# EAGLE design stirrer (EAGLE 7.2.0)
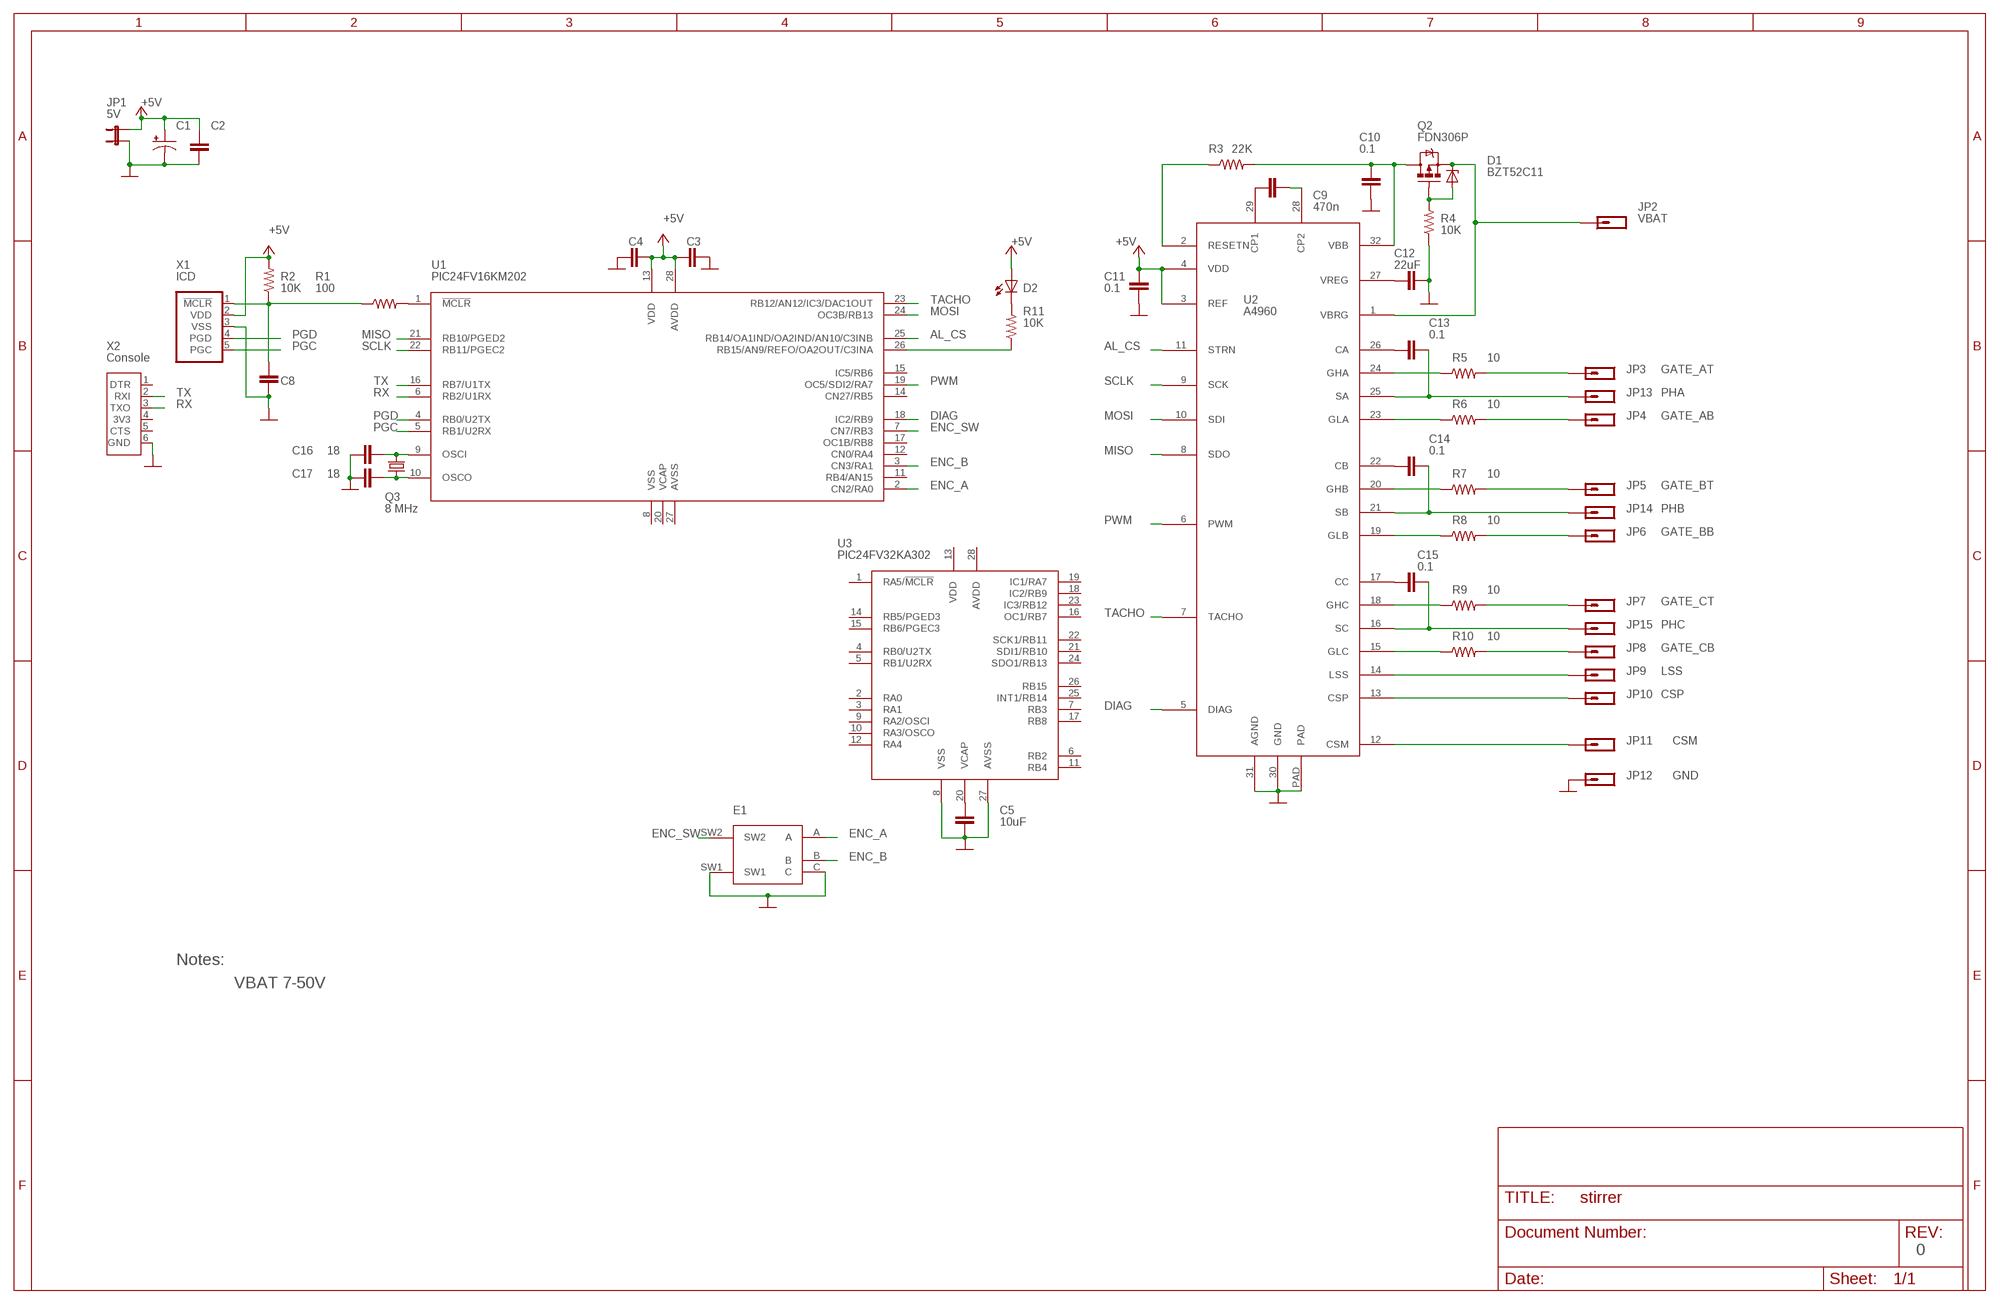
[diagram p0: schematic, sheet 1]

## Parts
C1  CAP_POL-RAD8  [CAP_RAD_8MM]
C2  CAP0603  [0603]
C3  0.1uF  C-0603  [0603]
C4  0.1uF  C-0603  [0603]
C5  10uF  C-0603  [0603]
C8  0.1uF  C-0603  [0603]
C9  470n  C-0603  [0603]
C10  0.1  C-0603  [0603]
C11  0.1  C-0603  [0603]
C12  22uF  CAP1206  [1206]
C13  0.1  C-0603  [0603]
C14  0.1  C-0603  [0603]
C15  0.1  C-0603  [0603]
C16  18  C-0603  [0603]
C17  18  C-0603  [0603]
D1  BZT52C11  ZENER-SOD-123  [SOD-123]
D2  LED5MM  [LED5MM]
E1  ROTARY_ENCODER_SWITCH-LUT  [PEC12-LUT]
JP1  5V  JP1EPTH  [1X02]
JP2  VBAT  M01-TT  [1X01_TT]
JP3  GATE_AT  M01-TT  [1X01_TT]
JP4  GATE_AB  M01-TT  [1X01_TT]
JP5  GATE_BT  M01-TT  [1X01_TT]
JP6  GATE_BB  M01-TT  [1X01_TT]
JP7  GATE_CT  M01-TT  [1X01_TT]
JP8  GATE_CB  M01-TT  [1X01_TT]
JP9  LSS  M01-TT  [1X01_TT]
JP10  CSP  M01-TT  [1X01_TT]
JP11  CSM  M01-TT  [1X01_TT]
JP12  GND  M01-TT  [1X01_TT]
JP13  PHA  M01-TT  [1X01_TT]
JP14  PHB  M01-TT  [1X01_TT]
JP15  PHC  M01-TT  [1X01_TT]
Q2  FDN306P  MOSFET-PCHANNEL-DPAK  [DPAK]
Q3  8 MHz  CRYSTAL_SFEHC49US  [HC49US]
R1  100  RESISTOR-0603  [0603]
R2  10K  RESISTOR-0603  [0603]
R3  22K  RESISTOR-0603  [0603]
R4  10K  RESISTOR-0603  [0603]
R5  10  RESISTOR-0603  [0603]
R6  10  RESISTOR-0603  [0603]
R7  10  RESISTOR-0603  [0603]
R8  10  RESISTOR-0603  [0603]
R9  10  RESISTOR-0603  [0603]
R10  10  RESISTOR-0603  [0603]
R11  10K  RESISTOR-0603  [0603]
U1  PIC24FV16KM202  PIC24FX16KM202-DIP  [DIL28-3]
U2  A4960  [LQPF-32]
U3  PIC24FV32KA302  PIC24FV32KA302_STIR-DIP  [DIL28-3]
X1  ICD  PIC_ICD-TT  [1X05-TT]
X2  Console  SERIAL-SFTT  [1X06TT]

## Nets
+5V: C1.P(+) C2.1 C3.1 C4.2 C11.2 D2.A JP1.2 R2.2 U1.13(VDD) U1.28(AVDD) U2.3(REF) U2.4(VDD) X1.2(VDD)
AL_CS: U1.25(RB14/OA1IND/OA2IND/AN10/C3INB) U2.11(STRN)
CSM: JP11.1 U2.12(CSM)
CSP: JP10.1 U2.13(CSP)
DIAG: U1.18(IC2/RB9) U2.5(DIAG)
ENC_A: E1.A U1.2(CN2/RA0)
ENC_B: E1.B U1.3(CN3/RA1)
ENC_SW: E1.SW2 U1.7(CN7/RB3)
GATE_AB: JP4.1 R6.2
GATE_AT: JP3.1 R5.2
GATE_BB: JP6.1 R8.2
GATE_BT: JP5.1 R7.2
GATE_CB: JP8.1 R10.2
GATE_CT: JP7.1 R9.2
GND: C1.N(-) C2.2 C3.2 C4.1 C5.2 C8.1 C10.1 C11.1 C12.2 C16.1 C17.1 E1.C E1.SW1 JP1.1 JP12.1 R4.1 U2.30(GND) U2.31(AGND) U2.PAD U3.8(VSS) U3.27(AVSS) X1.3(VSS) X2.6(GND)
LSS: JP9.1 U2.14(LSS)
MISO: U1.21(RB10/PGED2) U2.8(SDO)
MOSI: U1.24(OC3B/RB13) U2.10(SDI)
N$1: C5.1 U3.20(VCAP)
N$2: R1.2 U1.1(!MCLR)
N$3: R11.1 U1.26(RB15/AN9/REFO/OA2OUT/C3INA)
N$5: C9.1 U2.29(CP1)
N$9: D2.K(C) R11.2
N$11: C9.2 U2.28(CP2)
N$12: C8.2 R1.1 R2.1 X1.1(!MCLR)
N$14: R3.1 U2.2(RESETN)
N$15: C10.2 Q2.4(D) R3.2 U2.32(VBB)
N$16: C12.1 U2.27(VREG)
N$17: C13.2 U2.26(CA)
N$18: D1.A Q2.1(G) R4.2
N$19: C14.2 U2.22(CB)
N$20: C15.2 U2.17(CC)
N$21: C13.1 JP13.1 U2.25(SA)
N$22: C14.1 JP14.1 U2.21(SB)
N$23: C15.1 JP15.1 U2.16(SC)
N$24: R5.1 U2.24(GHA)
N$25: R7.1 U2.20(GHB)
N$26: R9.1 U2.18(GHC)
N$27: R6.1 U2.23(GLA)
N$28: R8.1 U2.19(GLB)
N$29: R10.1 U2.15(GLC)
N$30: C16.2 Q3.2 U1.9(OSCI)
N$31: C17.2 Q3.1 U1.10(OSCO)
PGC: U1.5(RB1/U2RX) X1.5(PGC)
PGD: U1.4(RB0/U2TX) X1.4(PGD)
PWM: U1.19(OC5/SDI2/RA7) U2.6(PWM)
RX: U1.6(RB2/U1RX) X2.3(TXO)
SCLK: U1.22(RB11/PGEC2) U2.9(SCK)
TACHO: U1.23(RB12/AN12/IC3/DAC1OUT) U2.7(TACHO)
TX: U1.16(RB7/U1TX) X2.2(RXI)
VBAT: D1.K(C) JP2.1 Q2.3(S) U2.1(VBRG)
Unconnected: U1.8(VSS) U1.11(RB4/AN15) U1.12(CN0/RA4) U1.14(CN27/RB5) U1.15(IC5/RB6) U1.17(OC1B/RB8) U1.20(VCAP) U1.27(AVSS) U3.1(RA5/!MCLR) U3.2(RA0) U3.3(RA1) U3.4(RB0/U2TX) U3.5(RB1/U2RX) U3.6(RB2) U3.7(RB3) U3.9(RA2/OSCI) U3.10(RA3/OSCO) U3.11(RB4) U3.12(RA4) U3.13(VDD) U3.14(RB5/PGED3) U3.15(RB6/PGEC3) U3.16(OC1/RB7) U3.17(RB8) U3.18(IC2/RB9) U3.19(IC1/RA7) U3.21(SDI1/RB10) U3.22(SCK1/RB11) U3.23(IC3/RB12) U3.24(SDO1/RB13) U3.25(INT1/RB14) U3.26(RB15) U3.28(AVDD) X2.1(DTR) X2.4(3V3) X2.5(CTS)

## Notes on the sheet
- Notes:
- VBAT 7-50V
- 0

## Library data of the parts
C1 = ch_passive:CAP_POL: Capacitor Polarized These are standard SMD and PTH capacitors. Normally 10uF, 47uF, and 100uF in electrolytic and tantalum varieties. Always verify the external diameter of the through hole cap, it varies with capacity, voltage, and manufacturer. The EIA devices should be standard.
C2 C12 = ch_passive:CAP: Capacitor Standard 0603 ceramic capacitor, and 0.1" leaded capacitor.
C3-C5 C8-C11 C13-C17 = ch_passive:C: CAPACITOR naming: grid - package width
D1 = ch_generic:ZENER: Zener Diode
D2 = ch_generic:LED: LEDs Standard schematic elements and footprints for 5mm, 3mm, 1206, and 0603 sized LEDs. 5mm - Spark Fun Electronics SKU : COM-00529 (and others)
E1 = ch_electromech:ROTARY_ENCODER_SWITCH: Rotary Encoder PEC12_HOR - Bourns horizontal PEC12
JP1 = ch_connectors:JP1E: Jumper Basic 0.1" spaced jumper. Use with breakaway headers.
JP2-JP15 = ch_connectors:M01: Header 1 Standard 1-pin 0.1" header. Use with straight break away headers (SKU : PRT-00116), right angle break away headers (PRT-00553), swiss pins (PRT-00743), machine pins (PRT-00117), and female headers (PRT-00115).
Q2 = ch_generic:MOSFET-PCHANNEL: MOSFET-P
Q3 = ch_passive:CRYSTAL_SFE: Crystals Various standard crystals
R1-R11 = ch_passive:RESISTOR: Resistor Basic schematic elements and footprints for 0603, 1206, and PTH 1/10th watt (small) resistors.
U1 = ch_microchip:PIC24FX16KM202
U2 = ch_allegro:A4960
U3 = ch_microchip:PIC24FV32KA302_STIR
X1 = ch_connectors:PIC_ICD
X2 = ch_connectors:SERIAL

## Board
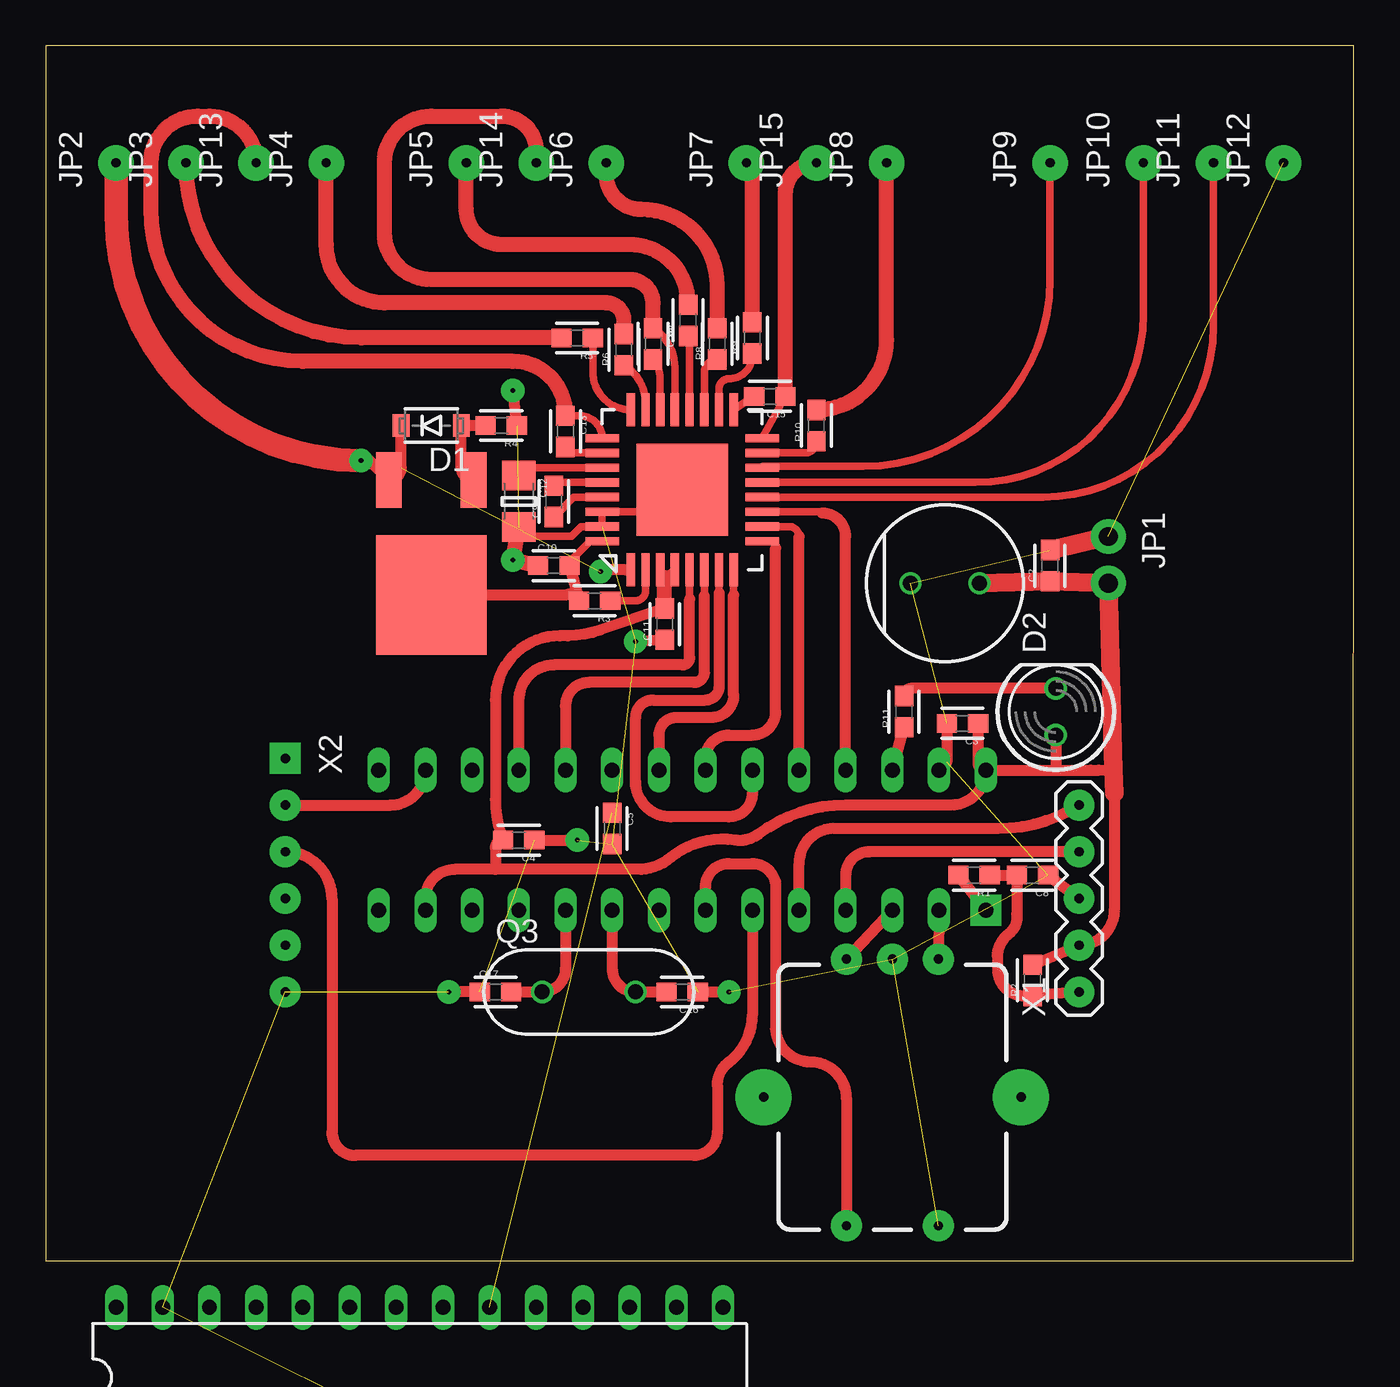
[diagram p1: board, top side]
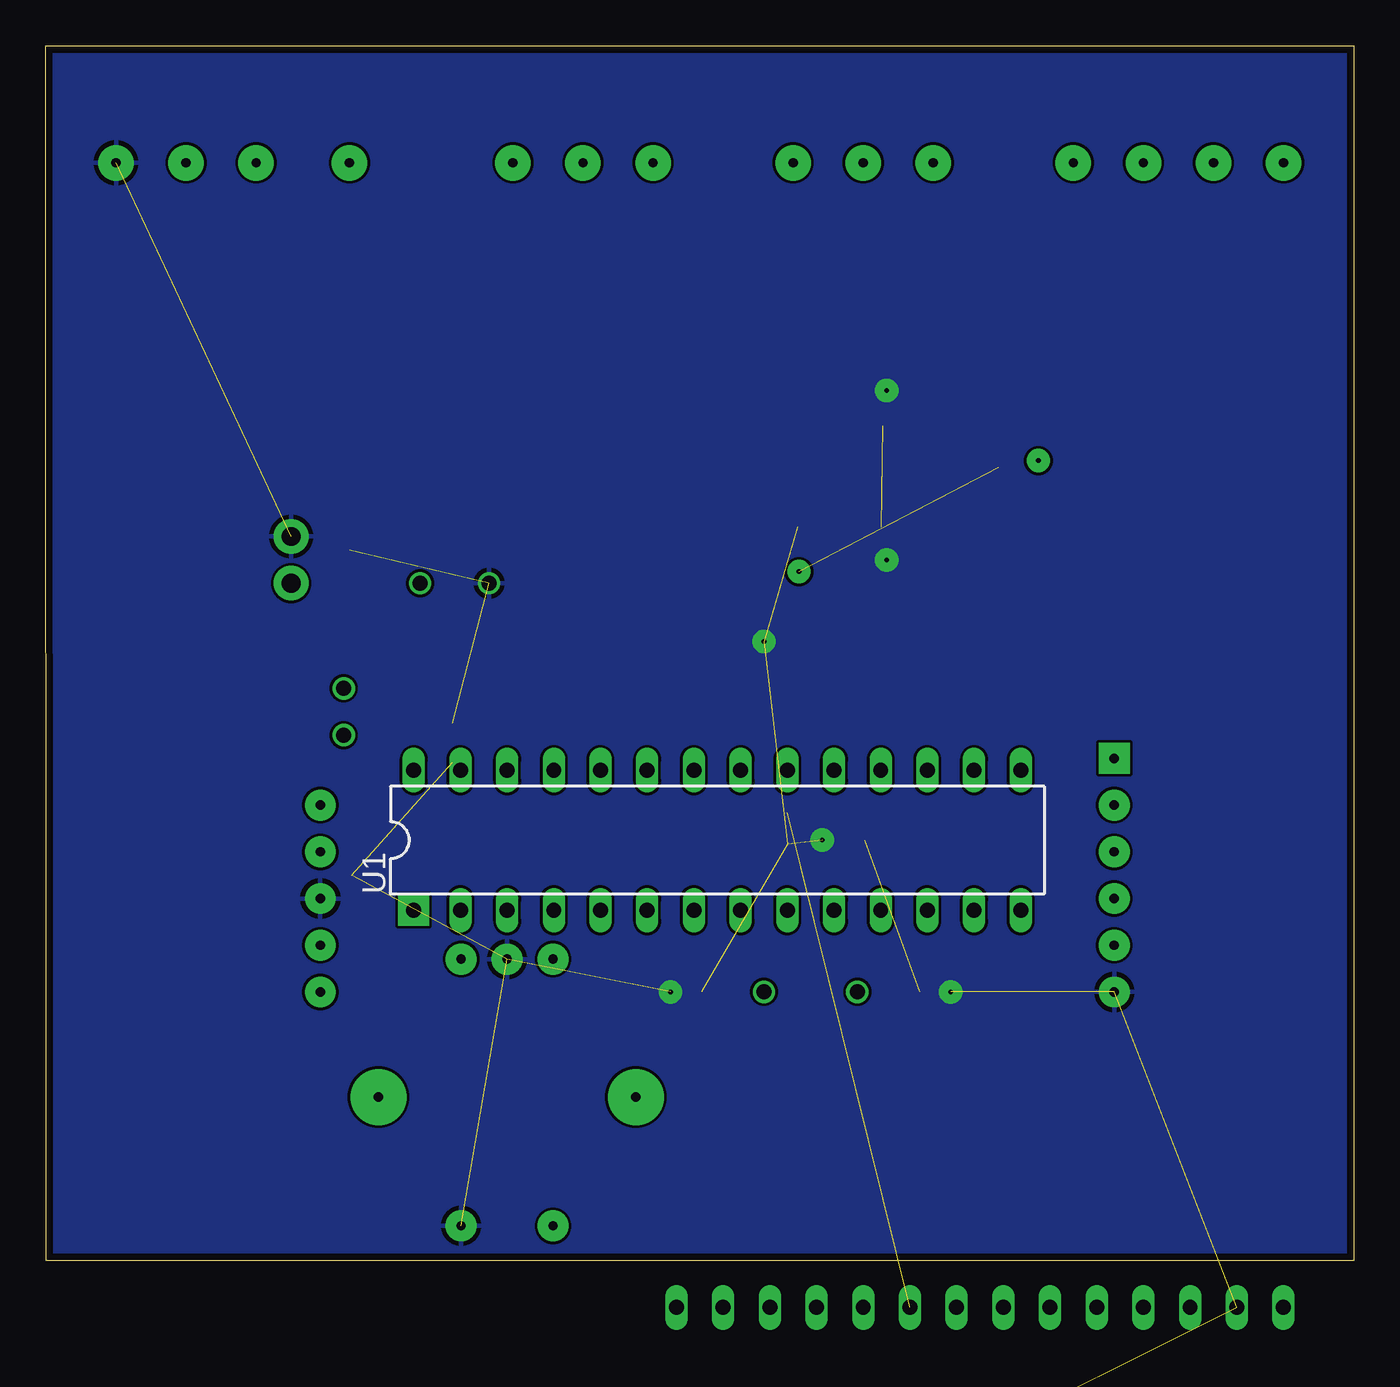
[diagram p2: board, bottom side, seen from below]

Size 71.12 x 66.04 mm. Coordinates in mm from the lower left corner, seen from the top.
Outline: 0,0 71.1,0 71.12,66.04 0,66.04 0,0
Copper layers (1*16): Top 0.0356mm / dielectric 1.5011mm / Bottom 0.0356mm
Design rules "CH_TT": minimum track width 6mil, minimum drill 1mil, track to track 6mil, track to pad 6mil, pad to pad 6mil, via to via 6mil, smd to smd 6mil, copper to edge 15mil, drill to drill 6mil, minimum pad ring 7mil, minimum via ring 7mil, stop-mask expansion 4mil, vias tented up to drill 20mil, thermal gap 10mil

### Footprints (pad centres in the part's own frame; a part is rotated, then mirrored left to right if it is on the bottom)
CAP_RAD_8MM = drill 0.8: N -1.875,0; P 1.875,0
0603 = smd 1.1 x 1: 1 -0.85,0; 2 0.85,0
1206 = smd 1.6 x 1.8: 1 -1.4,0; 2 1.4,0
SOD-123 = smd 0.91 x 1.22: A -1.635,0; K 1.635,0
LED5MM = drill 0.813: A -1.27,0; K 1.27,0
PEC12-LUT = drill 0.508 pad 1.676: A -2.5,-7.5; B 2.5,-7.5; C 0,-7.5; SW1 -2.5,7; SW2 2.5,7 | drill 0.508 pad 3.048: P$1 -7,0; P$2 7,0
1X02 = drill 1.016 pad 1.88: 1 0,0; 2 2.54,0
1X01_TT = drill 0.508 pad 1.93: 1 0,0
DPAK = smd 1.4 x 3: 1 -2.3,-6.25; 3 2.3,-6.25 | smd 6 x 6.5: 4 0,0
HC49US = drill 0.813: 1 -2.54,0; 2 2.54,0
DIL28-3 = drill 0.813 pad 1.676 square: 1 -16.51,-3.81 | drill 0.813 long: 2 -13.97,-3.81; 3 -11.43,-3.81; 4 -8.89,-3.81; 5 -6.35,-3.81; 6 -3.81,-3.81; 7 -1.27,-3.81; 8 1.27,-3.81; 9 3.81,-3.81; 10 6.35,-3.81; 11 8.89,-3.81; 12 11.43,-3.81; 13 13.97,-3.81; 14 16.51,-3.81; 15 16.51,3.81; 16 13.97,3.81; 17 11.43,3.81; 18 8.89,3.81; 19 6.35,3.81; 20 3.81,3.81; 21 1.27,3.81; 22 -1.27,3.81; 23 -3.81,3.81; 24 -6.35,3.81; 25 -8.89,3.81; 26 -11.43,3.81; 27 -13.97,3.81; 28 -16.51,3.81
LQPF-32 = smd 0.45 x 1.8: 1 -2.8,-4.35; 2 -2,-4.35; 3 -1.2,-4.35; 4 -0.4,-4.35; 5 0.4,-4.35; 6 1.2,-4.35; 7 2,-4.35; 8 2.8,-4.35; 17 2.8,4.35; 18 2,4.35; 19 1.2,4.35; 20 0.4,4.35; 21 -0.4,4.35; 22 -1.2,4.35; 23 -2,4.35; 24 -2.8,4.35 | smd 1.8 x 0.45: 9 4.35,-2.8; 10 4.35,-2; 11 4.35,-1.2; 12 4.35,-0.4; 13 4.35,0.4; 14 4.35,1.2; 15 4.35,2; 16 4.35,2.8; 25 -4.35,2.8; 26 -4.35,2; 27 -4.35,1.2; 28 -4.35,0.4; 29 -4.35,-0.4; 30 -4.35,-1.2; 31 -4.35,-2; 32 -4.35,-2.8 | smd 5 x 5: PAD 0,0
1X05-TT = drill 0.508 pad 1.676: 1 -5.08,0; 2 -2.54,0; 3 0,0; 4 2.54,0; 5 5.08,0
1X06TT = drill 0.508 pad 1.676 square: 1 -6.35,0 | drill 0.508 pad 1.676: 2 -3.81,0; 3 -1.27,0; 4 1.27,0; 5 3.81,0; 6 6.35,0

### Placement (x,y rotation side)
C1  48.9,36.83 0 top
C2  54.61,37.78 90 top
C3  49.85,29.21 180 top
C4  25.72,22.86 180 top
C5  30.8,23.5 270 top
C8  53.66,20.95 180 top
C9  27.62,41.27 90 top
C10  27.62,37.78 0 top
C11  33.66,34.61 90 top
C12  25.72,41.27 270 top
C13  28.26,45.09 270 top
C14  33.02,49.85 270 top
C15  39.37,46.99 180 top
C16  34.61,14.61 180 top
C17  24.45,14.61 0 top
D1  20.95,45.4 180 top
D2  54.93,29.84 90 top
E1  46.04,8.89 180 top
JP1  57.78,39.37 270 top
JP2  3.81,59.69 90 top
JP3  7.62,59.69 90 top
JP4  15.24,59.69 90 top
JP5  22.86,59.69 90 top
JP6  30.48,59.69 90 top
JP7  38.1,59.69 90 top
JP8  45.72,59.69 90 top
JP9  54.61,59.69 90 top
JP10  59.69,59.69 90 top
JP11  63.5,59.69 90 top
JP12  67.31,59.69 90 top
JP13  11.43,59.69 90 top
JP14  26.67,59.69 90 top
JP15  41.91,59.69 90 top
Q2  20.95,36.2 180 top
Q3  29.53,14.61 0 top
R1  50.48,20.95 180 top
R2  53.66,15.24 90 top
R3  29.84,35.88 180 top
R4  24.77,45.4 180 top
R5  28.89,50.16 180 top
R6  31.43,49.53 90 top
R7  34.92,51.12 90 top
R8  36.51,49.85 90 top
R9  38.42,50.16 90 top
R10  41.91,45.4 90 top
R11  46.67,29.84 90 top
U1  34.61,22.86 0 bottom
U2  34.61,41.91 0 top
U3  20.32,-6.35 0 top
X1  56.2,19.68 90 top
X2  13.02,20.95 270 top

### Tracks (layer width: path | path; a pad name or v marks a point on that pad's centre or on a via)
+5V
  Top 0.406: U2.4 33.66,37.15 U2.3
  Top 0.61: C3.1 50.7,27.09 arc90 U1.28 | R2.2 X1.2 arc90 58.1,19.05 58.1,25.4 | U1.13 20.64,19.68 arc-90 22.23,21.27 24.45,21.27 | U1.28 54.93,26.67 | 54.93,26.67 56.83,26.67 arc2 58.07,26.69 | D2.A 54.93,26.67 | U1.28 arc-90 49.21,24.77 43.5,24.77 arc37 38.73,23.18 arc-46 37.47,22.86 arc48 33.97,21.91 arc-35 32.38,21.27 24.45,21.27 | 24.45,21.27 24.45,22.44 arc-90 C4.2 arc-21 24.45,25.08 24.45,30.48 arc-90 27.94,33.97 arc21 30.16,34.29 C11.2
  Top 0.813: C11.2 33.66,37.15
  Top 1.016: C1.P C2.1 JP1.2 58.07,26.69 58.1,25.4
AL_CS
  Top 0.406: U2.11 42.16,40.71 arc-90 42.23,40.64
  Top 0.61: U1.25 43.5,39.37 arc90 42.23,40.64
CSM
  Top 0.406: U2.12 54.21,41.51 arc90 63.5,50.8 JP11.1
CSP
  Top 0.406: U2.13 50.56,42.31 arc90 59.69,51.44 JP10.1
DIAG
  Top 0.406: U2.5 35.01,35.96
  Top 0.61: U1.18 25.72,30.48 arc-90 27.62,32.38 34.61,32.38 arc90 35.01,32.78 35.01,35.96
ENC_A
  Top 0.61: U1.2 E1.A
ENC_B
  Top 0.61: U1.3 E1.B
ENC_SW
  Top 0.61: U1.7 35.88,20.32 arc-90 37.15,21.59 38.42,21.59 arc-90 39.69,20.32 39.69,12.7 arc90 41.59,10.79 arc-90 43.54,8.85 E1.SW2
GATE_AB
  Top 0.813: R6.2 31.43,51.12 arc90 30.48,52.07 18.41,52.07 arc-90 15.24,55.24 JP4.1
GATE_AT
  Top 0.813: R5.2 17.14,50.16 arc-90 JP3.1
GATE_BB
  Top 0.813: R8.2 36.51,53.02 arc90 32.38,57.15 arc-90 30.48,59.05 JP6.1
GATE_BT
  Top 0.813: R7.2 34.92,52.07 arc90 31.75,55.24 24.77,55.24 arc-90 22.86,57.15 JP5.1
GATE_CB
  Top 0.813: R10.2 arc90 45.72,50.06 JP8.1
GATE_CT
  Top 0.813: R9.2 38.42,59.37 arc90 JP7.1
GND  (via drill 0.25 pad 1.27)  (16 unrouted)
  Top 0.406: C12.2 26.22,39.37 28.57,39.37 29.11,39.91 U2.31 U2.30 33.41,40.71 arc90 U2.PAD
  Top 0.61: C3.2 49,27.09 | C11.1 v32.07,33.66 | C4.1 v28.89,22.86 | C17.1 v21.91,14.61 | C16.1 v37.15,14.61 | C8.1 X1.3 | R4.1 v25.4,47.31
  Top 0.813: C12.2 v25.4,38.1 C10.1
  Top 1.016: C2.2 JP1.1
  pour Bottom: 0,0 71.12,0 71.12,66.04 0,66.04
LSS
  Top 0.406: U2.14 arc-90 39.03,43.18 44.45,43.18 arc90 54.61,53.34 JP9.1
MISO
  Top 0.406: 37.41,35.82 37.41,36.2 U2.8
  Top 0.61: 37.41,36.2 37.41,30.74 arc-90 36.2,29.53 34.29,29.53 arc90 33.34,28.57 U1.21
MOSI
  Top 0.406: U2.10 40.42,39.91 arc-90 40.96,39.37
  Top 0.61: U1.24 40.96,39.37
N$1  (1 unrouted)
N$2
  Top 0.61: R1.2 U1.1
N$3
  Top 0.61: U1.26 R11.1
N$5
  Top 0.406: U2.29 28.71,41.51 C9.1
N$9
  Top 0.61: D2.K 47.09,31.11 arc90 R11.2
N$11
  Top 0.406: U2.28 27.81,42.31 arc90 C9.2
N$12
  Top 0.61: X1.1 R2.1 53.24,14.39 arc-90 51.75,15.88 51.75,16.51 arc-53 52.39,17.78 arc63 52.81,18.84 C8.2 R1.1
N$14
  Top 0.406: U2.2 32.61,36.42 arc-90 32.07,35.88 R3.1
N$15
  Top 0.406: U2.32 29.59,39.11 28.47,38 C10.2
  Top 0.61: C10.2 28.86,36.36 | 28.86,36.36 R3.2 | Q2.4 28.26,36.2 28.86,36.36
N$16
  Top 0.406: U2.27 25.52,43.11 arc90 C12.1
N$17
  Top 0.406: U2.26 28.58,43.91 arc-90 C13.2
N$18
  Top 0.61: Q2.1 arc-90 22.59,43.11 D1.A R4.2
N$19
  Top 0.406: U2.22 33.41,47.98 arc42 C14.2
N$20
  Top 0.406: U2.17 C15.2
N$21
  Top 0.406: C13.1 29.03,45.94 arc-90 U2.25
  Top 0.813: C13.1 28.26,46.04 arc90 25.4,48.9 13.97,48.9 arc-90 5.71,57.15 5.71,59.69 arc-90 8.26,62.23 8.89,62.23 arc-90 JP13.1
N$22
  Top 0.406: U2.21 34.21,48.56 arc58 C14.1
  Top 0.813: C14.1 33.02,52.07 arc90 31.75,53.34 20.95,53.34 arc-90 18.41,55.88 18.41,59.69 arc-90 20.95,62.23 24.77,62.23 arc-90 26.67,60.33 JP14.1
N$23
  Top 0.406: U2.16 C15.1
  Top 0.813: C15.1 40.22,58 arc-90 JP15.1
N$24
  Top 0.406: R5.1 29.74,48.33 arc90 U2.24
N$25
  Top 0.406: U2.20 35.01,50.19 arc90 R7.1
N$26
  Top 0.406: U2.18 36.61,47.4 arc-90 37.15,47.94 arc90 38.42,49.21 R9.1
N$27
  Top 0.406: U2.23 32.61,46.55 arc23 32.38,47.62 arc37 R6.1
N$28
  Top 0.406: U2.19 35.81,48.29 arc-90 R8.1
N$29
  Top 0.406: U2.15 41.27,43.91 arc90 R10.1
N$30
  Top 0.61: U1.9 30.8,15.88 arc90 Q3.2 C16.2
N$31
  Top 0.61: U1.10 28.26,15.88 arc-90 Q3.1 C17.2
PGC
  Top 0.61: U1.5 40.96,21.59 arc-90 42.86,23.5 51.75,23.5 arc32 X1.5
PGD
  Top 0.61: X1.4 44.77,22.23 arc90 43.5,20.95 U1.4
PWM
  Top 0.406: U2.6 35.81,36.12
  Top 0.61: U1.19 28.26,30.16 arc-90 29.53,31.43 35.24,31.43 arc90 35.81,32 35.81,36.12
RX
  Top 0.61: U1.6 38.42,13.34 arc-53 37.15,10.79 arc53 36.51,9.53 36.51,6.99 arc-90 35.24,5.71 16.83,5.71 arc-90 15.56,6.99 15.56,19.68 arc90 X2.3
SCLK
  Top 0.406: U2.9 39.69,39.11 39.69,38.73
  Top 0.61: 39.69,38.73 39.69,29.84 arc-90 38.42,28.57 37.15,28.57 arc90 35.88,27.3 U1.22
TACHO
  Top 0.406: 36.61,36.29 U2.7
  Top 0.61: U1.23 38.42,25.4 arc-90 37.15,24.13 33.97,24.13 arc-90 32.07,26.04 32.07,29.53 arc-90 33.02,30.48 35.88,30.48 arc90 36.61,31.21 36.61,36.29
TX
  Top 0.61: X2.2 18.73,24.77 arc90 U1.16
VBAT  (via drill 0.25 pad 1.27)  (1 unrouted)
  Top 0.406: U2.1 31.53,37.56
  Top 0.61: 31.53,37.56 30.26,37.56 arc90 v30.16,37.47 | D1.K 19.32,43.11 arc-90 Q2.3 17.6,43.5 v17.14,43.5
  Top 1.27: JP2.1 3.81,56.83 arc90 v17.14,43.5